# Altium schematic sheet STALO_3.SchDoc: STALO_3
size D; Date: 09-24-10; DrawnBy: C. Lewis; Engineer: C. Lewis; Address1: 4650 NORRIS CANYON RD.; Address2: SAN RAMON, CA 94583; DocumentNumber: 35133; Revision: D; SheetNumber: 20; SheetTotal: 20; PageSetup: Record=PageOptions|CenterHorizontal=True|CenterVertical=True|PrintScale=0.34|XCorrection=1.00|YCorrection=1.00|PrintKind=1|BorderSize=5000000|LeftOffset=0|BottomOffset=0|Orientation=2|PaperLength=1000|PaperWidth=1000|Scale=100|PaperSource=15|PrintQuality=600|MediaType=1|DitherType=10|PaperKind=11x17|PrintScaleMode=1; DocumentName: Sheet1.SCHDOC; ModifiedDate: 10-27-11
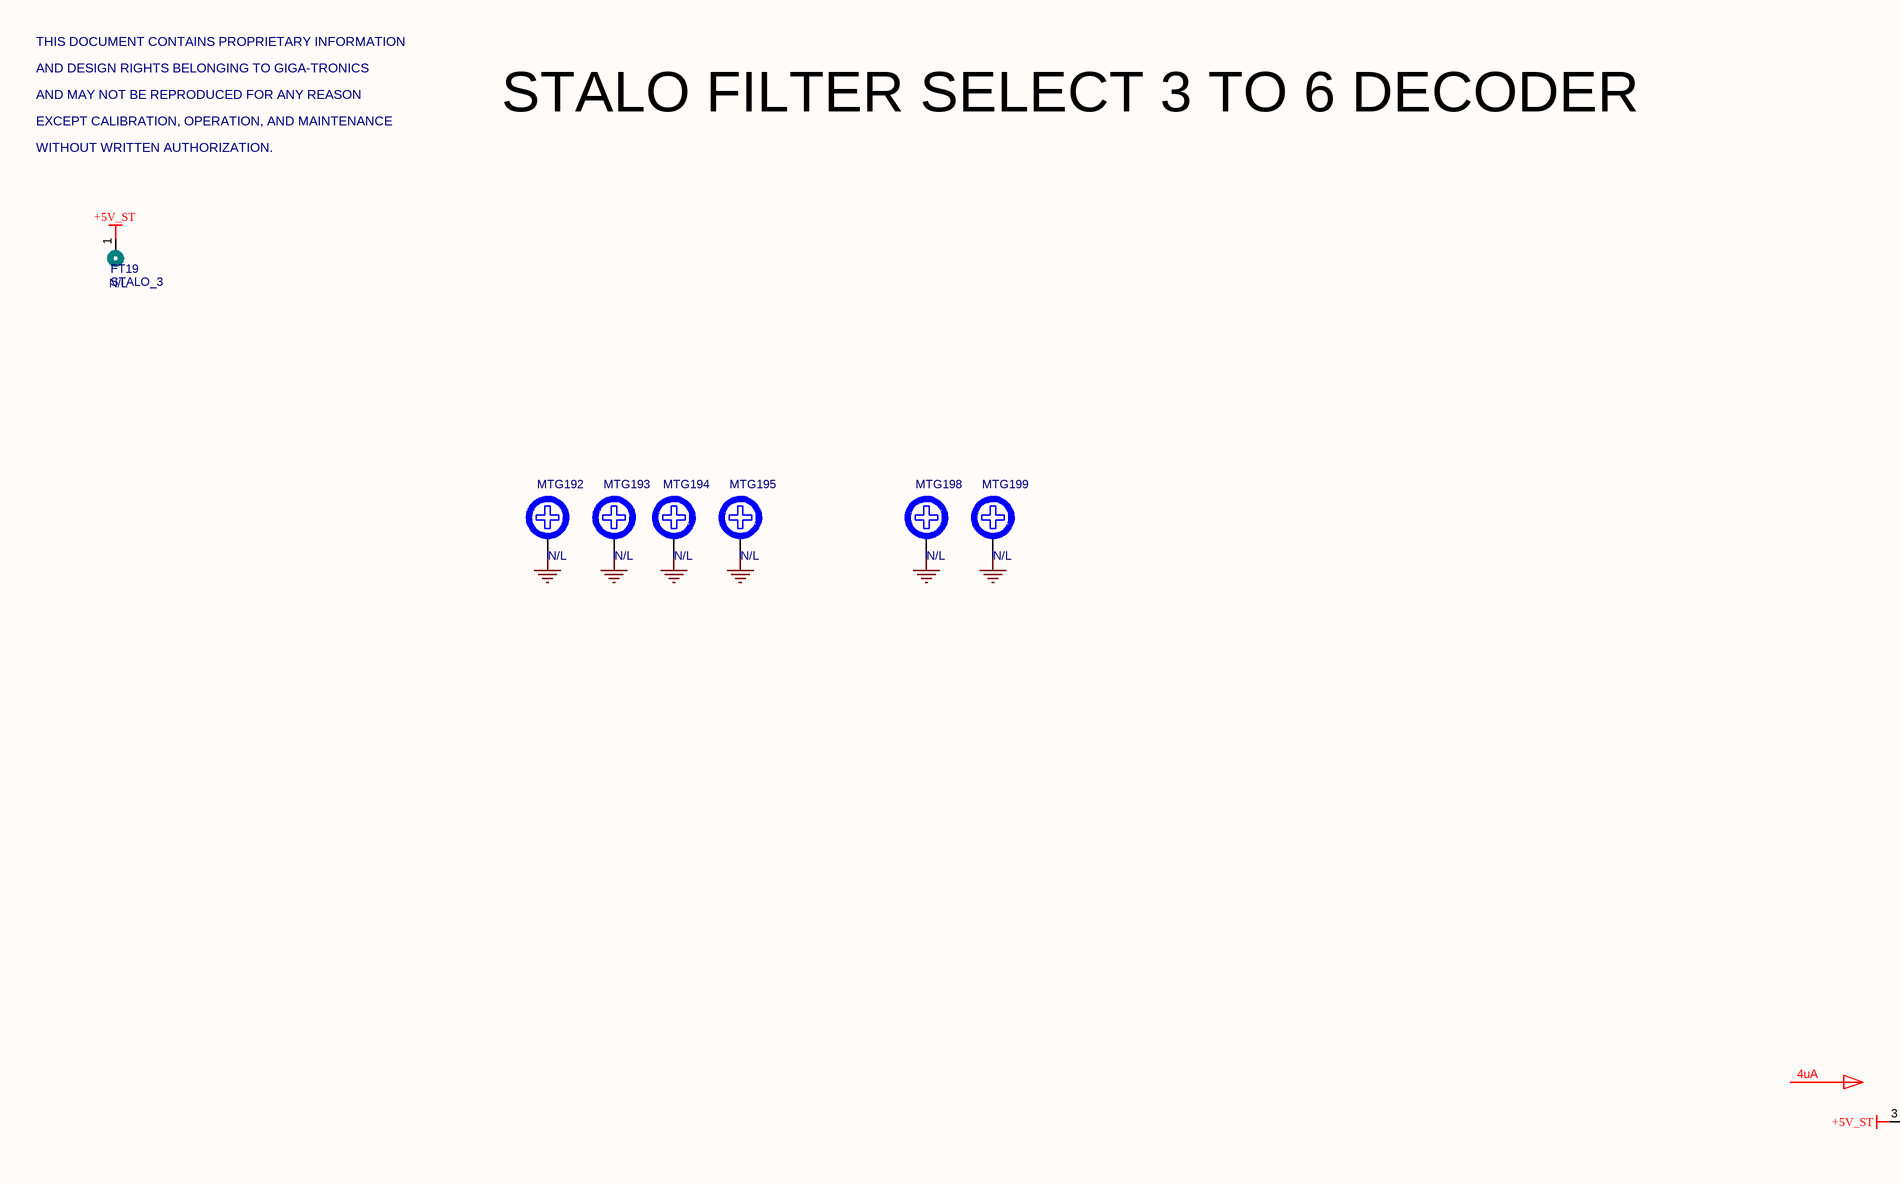
[diagram p0: STALO_3.SchDoc, top left]
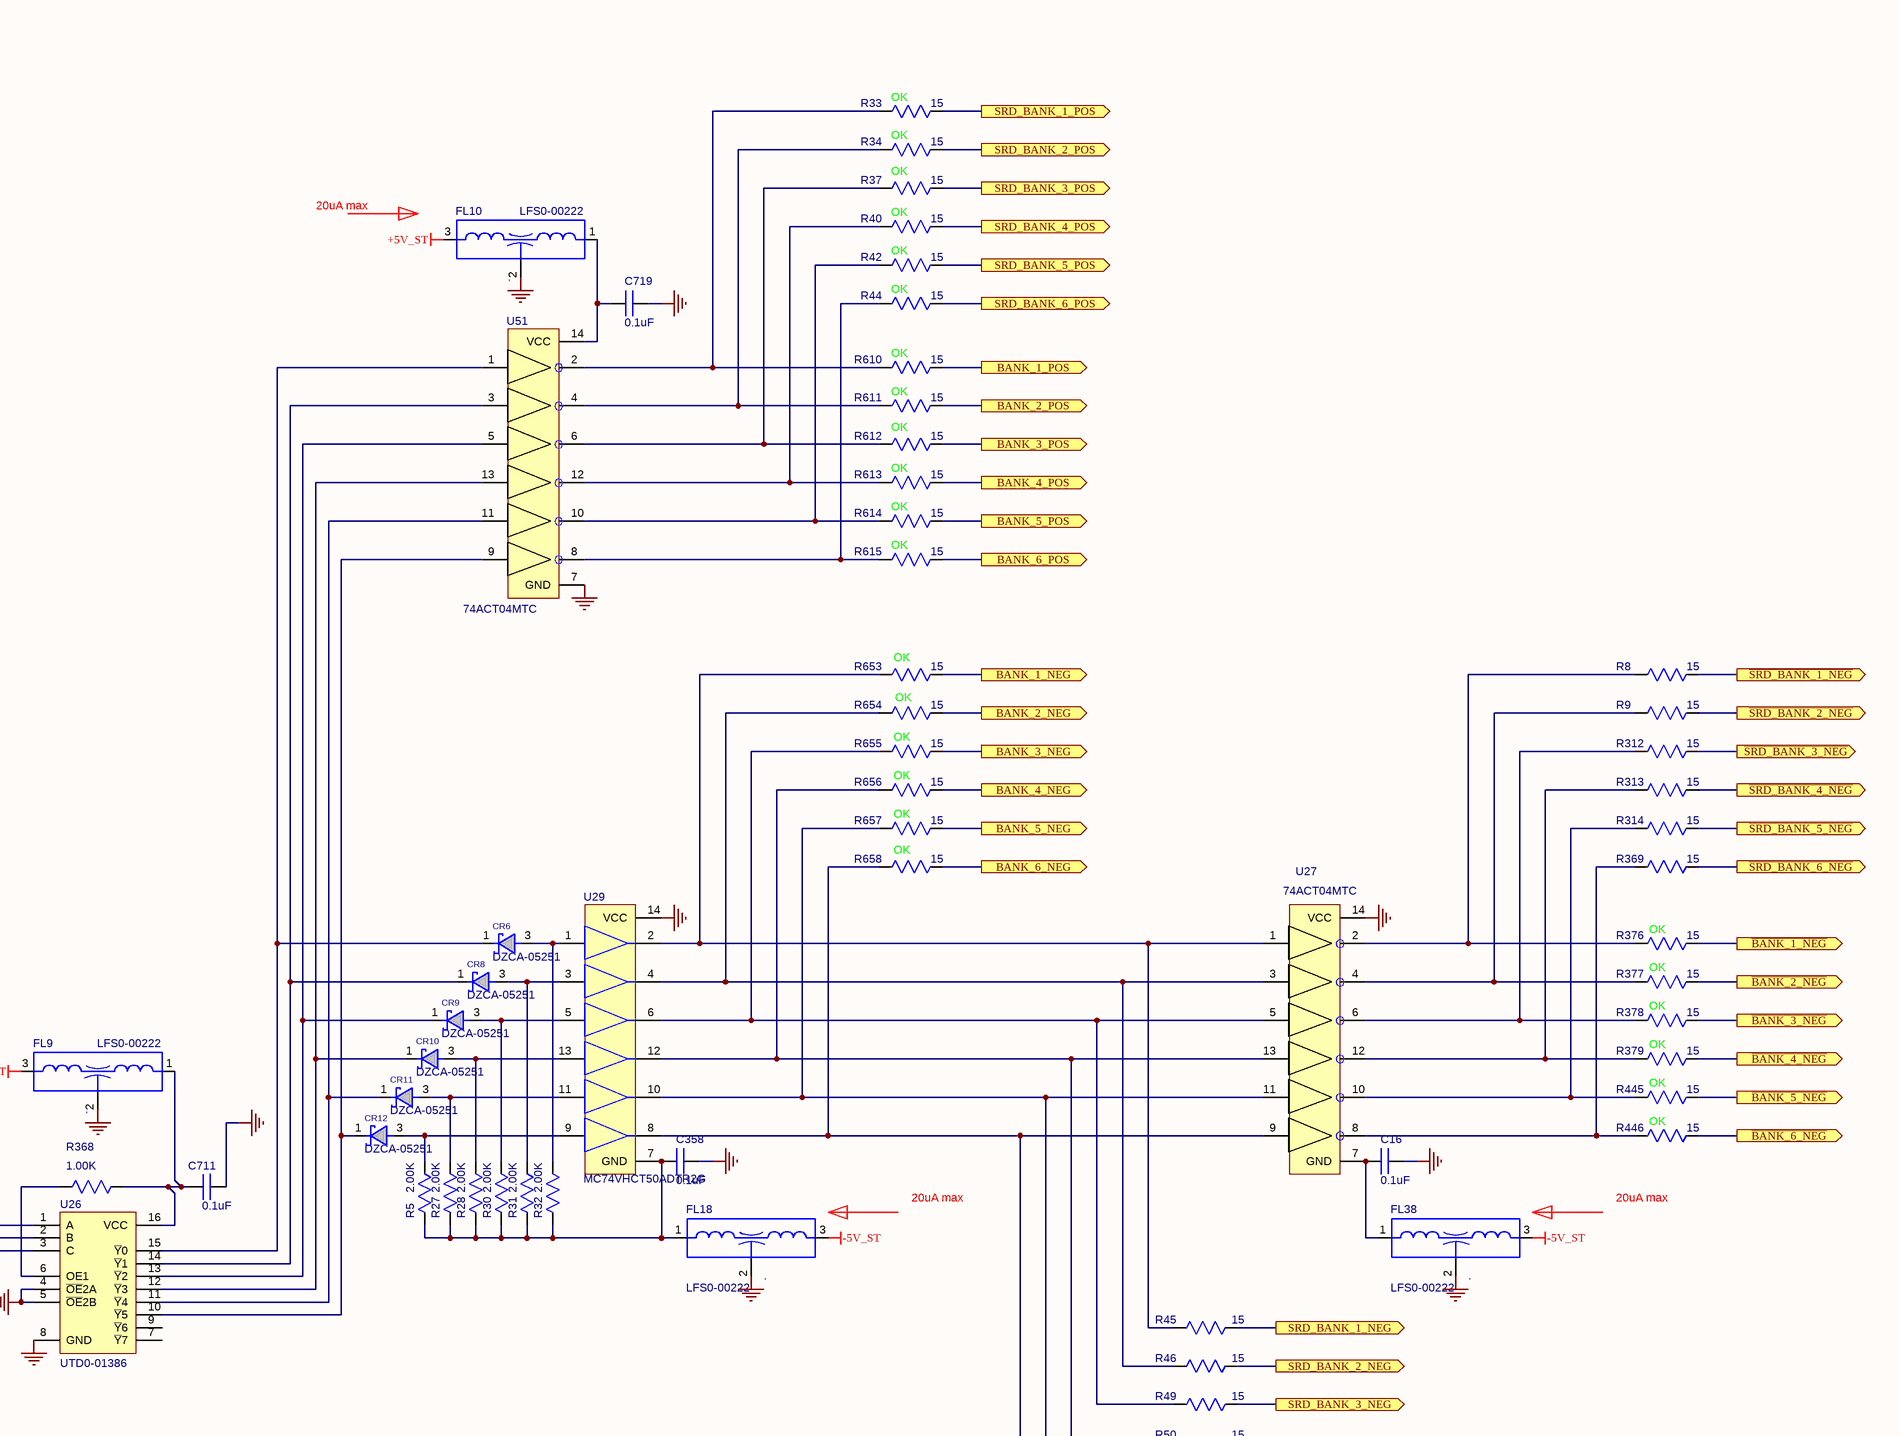
[diagram p1: STALO_3.SchDoc, top right]
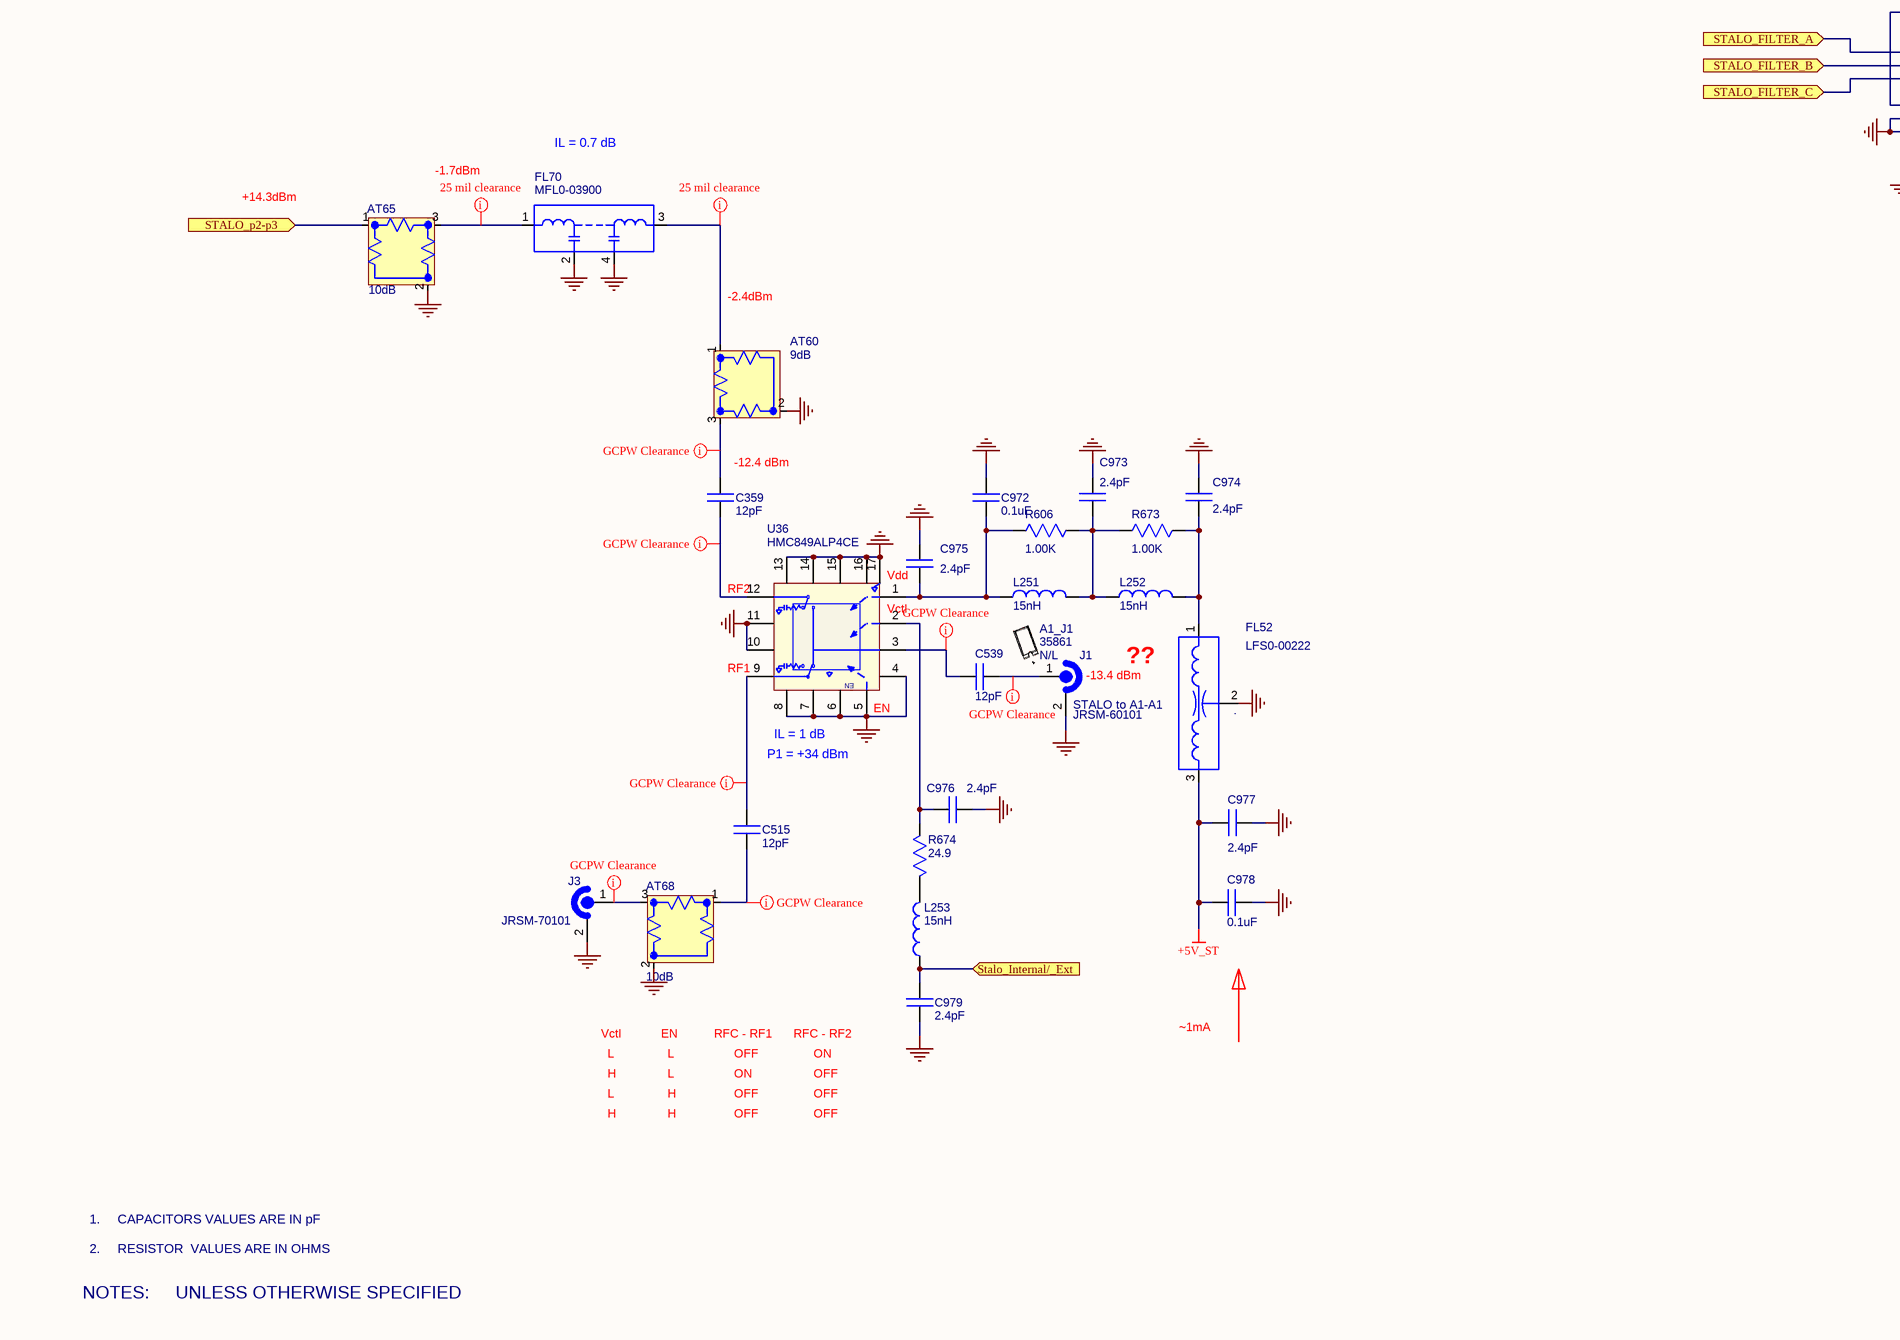
[diagram p2: STALO_3.SchDoc, bottom left]
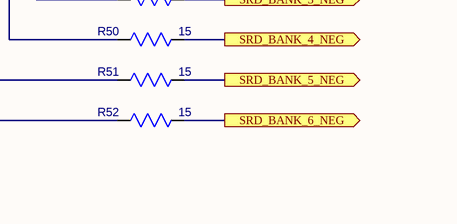
[diagram p3: STALO_3.SchDoc, bottom right]

## Parts
A1_J1  NoLoad: N/L  [35861]  (hidden comment: 35861)  (mechanical)
AT60  value 9dB  [ATTN-IMS-0805]  (hidden comment: PAD;CHIP;9dB;+/-.3dB;.08 x .05;50 OHM;FACE DOWN)
AT65  value 10dB  [ATTN-IMS-0805]  (hidden comment: PAD;CHIP;10dB;+/-.3dB;.08 x .05;50 OHM;FACE DOWN)
AT68  value 10dB  [ATTN-IMS-0805]  (hidden comment: PAD;CHIP;10dB;+/-.3dB;.08 x .05;50 OHM;FACE DOWN)
C16  value 0.1uF  [CAP-0402-N]  (hidden comment: .1 UF,10%;X7R;16V,CHIP;0402)
C358  value 0.1uF  [CAP-0402-N]  (hidden comment: .1 UF,10%;X7R;16V,CHIP;0402)
C359  value 12pF  [CAP-0402-N]  (hidden comment: 12 PF;5%;COG;>50V;CHIP;0402)
C515  value 12pF  [CAP-0402-N]  (hidden comment: 12 PF;5%;COG;>50V;CHIP;0402)
C539  value 12pF  [CAP-0402-N]  (hidden comment: 12 PF;5%;COG;>50V;CHIP;0402)
C711  value 0.1uF  [CAP-0402-N]  (hidden comment: .1 UF,10%;X7R;16V,CHIP;0402)
C719  value 0.1uF  [CAP-0402-N]  (hidden comment: .1 UF,10%;X7R;16V,CHIP;0402)
C972  value 0.1uF  [CAP-0402-N]  (hidden comment: .1 UF,10%;X7R;16V,CHIP;0402)
C973  value 2.4pF  [CAP-0402-RF]  (hidden comment: 2.4 PF;200V;.05PF;HIGH Q;SMT;CERAMIC;0402)
C974  value 2.4pF  [CAP-0402-RF]  (hidden comment: 2.4 PF;200V;.05PF;HIGH Q;SMT;CERAMIC;0402)
C975  value 2.4pF  [CAP-0402-RF]  (hidden comment: 2.4 PF;200V;.05PF;HIGH Q;SMT;CERAMIC;0402)
C976  value 2.4pF  [CAP-0402-RF]  (hidden comment: 2.4 PF;200V;.05PF;HIGH Q;SMT;CERAMIC;0402)
C977  value 2.4pF  [CAP-0402-RF]  (hidden comment: 2.4 PF;200V;.05PF;HIGH Q;SMT;CERAMIC;0402)
C978  value 0.1uF  [CAP-0402-N]  (hidden comment: .1 UF,10%;X7R;16V,CHIP;0402)
C979  value 2.4pF  [CAP-0402-RF]  (hidden comment: 2.4 PF;200V;.05PF;HIGH Q;SMT;CERAMIC;0402)
CR6  5.1V;5%;.15W;Z=20;0603  [DO-0603-SOD-523F]  (value not drawn)
CR8  5.1V;5%;.15W;Z=20;0603  [DO-0603-SOD-523F]  (value not drawn)
CR9  5.1V;5%;.15W;Z=20;0603  [DO-0603-SOD-523F]  (value not drawn)
CR10  5.1V;5%;.15W;Z=20;0603  [DO-0603-SOD-523F]  (value not drawn)
CR11  5.1V;5%;.15W;Z=20;0603  [DO-0603-SOD-523F]  (value not drawn)
CR12  5.1V;5%;.15W;Z=20;0603  [DO-0603-SOD-523F]  (value not drawn)
FL9  Filter EMI 2200PF,1206  [FIL-NFE31P-1206-4P]  (value not drawn)
FL10  Filter EMI 2200PF,1206  [FIL-NFE31P-1206-4P]  (value not drawn)
FL18  Filter EMI 2200PF,1206  [FIL-NFE31P-1206-4P]  (value not drawn)
FL38  Filter EMI 2200PF,1206  [FIL-NFE31P-1206-4P]  (value not drawn)
FL52  Filter EMI 2200PF,1206  [FIL-NFE31P-1206-4P]  (value not drawn)
FL70  FILTER;LOW PASS;3900MHz;7SEC;FV1206  [FV1206]  (value not drawn)
FT19  STALO_3  NoLoad: N/L  [FromToNode_ML2]  (net tie, no BOM)
J1  STALO to A1-A1  [JRSM-60101]
J3  .  [JRSM-70101]  (value not drawn)
L251  value 15nH  [IND-0402HP]  (hidden comment: INDUCTOR;15NH;2%;3.9GHZ SRF;85Q @1.7GHZ;.078 DCR;1.1A;0402)
L252  value 15nH  [IND-0402HP]  (hidden comment: INDUCTOR;15NH;2%;3.9GHZ SRF;85Q @1.7GHZ;.078 DCR;1.1A;0402)
L253  value 15nH  [IND-0402HP]  (hidden comment: INDUCTOR;15NH;2%;3.9GHZ SRF;85Q @1.7GHZ;.078 DCR;1.1A;0402)
MTG192  NoLoad: N/L  [MHP200X92]  (no BOM)
MTG193  NoLoad: N/L  [MHP200X92]  (no BOM)
MTG194  NoLoad: N/L  [MHP200X92]  (no BOM)
MTG195  NoLoad: N/L  [MHP200X92]  (no BOM)
MTG198  NoLoad: N/L  [MHP200X92]  (no BOM)
MTG199  NoLoad: N/L  [MHP200X92]  (no BOM)
R5  value 2.00K  [RES-0402-N]  (hidden comment: 2.00K OHMS;.06W;1%;200PPM;FILM;CHIP;0402)
R8  value 15  [RES-0402-N]  (hidden comment: 15 OHMS;.06W;1%;200PPM;FILM;CHIP;0402)
R9  value 15  [RES-0402-N]  (hidden comment: 15 OHMS;.06W;1%;200PPM;FILM;CHIP;0402)
R27  value 2.00K  [RES-0402-N]  (hidden comment: 2.00K OHMS;.06W;1%;200PPM;FILM;CHIP;0402)
R28  value 2.00K  [RES-0402-N]  (hidden comment: 2.00K OHMS;.06W;1%;200PPM;FILM;CHIP;0402)
R30  value 2.00K  [RES-0402-N]  (hidden comment: 2.00K OHMS;.06W;1%;200PPM;FILM;CHIP;0402)
R31  value 2.00K  [RES-0402-N]  (hidden comment: 2.00K OHMS;.06W;1%;200PPM;FILM;CHIP;0402)
R32  value 2.00K  [RES-0402-N]  (hidden comment: 2.00K OHMS;.06W;1%;200PPM;FILM;CHIP;0402)
R33  value 15  [RES-0402-N]  (hidden comment: 15 OHMS;.06W;1%;200PPM;FILM;CHIP;0402)
R34  value 15  [RES-0402-N]  (hidden comment: 15 OHMS;.06W;1%;200PPM;FILM;CHIP;0402)
R37  value 15  [RES-0402-N]  (hidden comment: 15 OHMS;.06W;1%;200PPM;FILM;CHIP;0402)
R40  value 15  [RES-0402-N]  (hidden comment: 15 OHMS;.06W;1%;200PPM;FILM;CHIP;0402)
R42  value 15  [RES-0402-N]  (hidden comment: 15 OHMS;.06W;1%;200PPM;FILM;CHIP;0402)
R44  value 15  [RES-0402-N]  (hidden comment: 15 OHMS;.06W;1%;200PPM;FILM;CHIP;0402)
R45  value 15  [RES-0402-N]  (hidden comment: 15 OHMS;.06W;1%;200PPM;FILM;CHIP;0402)
R46  value 15  [RES-0402-N]  (hidden comment: 15 OHMS;.06W;1%;200PPM;FILM;CHIP;0402)
R49  value 15  [RES-0402-N]  (hidden comment: 15 OHMS;.06W;1%;200PPM;FILM;CHIP;0402)
R50  value 15  [RES-0402-N]  (hidden comment: 15 OHMS;.06W;1%;200PPM;FILM;CHIP;0402)
R51  value 15  [RES-0402-N]  (hidden comment: 15 OHMS;.06W;1%;200PPM;FILM;CHIP;0402)
R52  value 15  [RES-0402-N]  (hidden comment: 15 OHMS;.06W;1%;200PPM;FILM;CHIP;0402)
R312  value 15  [RES-0402-N]  (hidden comment: 15 OHMS;.06W;1%;200PPM;FILM;CHIP;0402)
R313  value 15  [RES-0402-N]  (hidden comment: 15 OHMS;.06W;1%;200PPM;FILM;CHIP;0402)
R314  value 15  [RES-0402-N]  (hidden comment: 15 OHMS;.06W;1%;200PPM;FILM;CHIP;0402)
R368  value 1.00K  [RES-0402-N]  (hidden comment: 1.0K OHMS;.06W;1%;200PPM;FILM;CHIP;0402)
R369  value 15  [RES-0402-N]  (hidden comment: 15 OHMS;.06W;1%;200PPM;FILM;CHIP;0402)
R376  value 15  [RES-0402-N]  (hidden comment: 15 OHMS;.06W;1%;200PPM;FILM;CHIP;0402)
R377  value 15  [RES-0402-N]  (hidden comment: 15 OHMS;.06W;1%;200PPM;FILM;CHIP;0402)
R378  value 15  [RES-0402-N]  (hidden comment: 15 OHMS;.06W;1%;200PPM;FILM;CHIP;0402)
R379  value 15  [RES-0402-N]  (hidden comment: 15 OHMS;.06W;1%;200PPM;FILM;CHIP;0402)
R445  value 15  [RES-0402-N]  (hidden comment: 15 OHMS;.06W;1%;200PPM;FILM;CHIP;0402)
R446  value 15  [RES-0402-N]  (hidden comment: 15 OHMS;.06W;1%;200PPM;FILM;CHIP;0402)
R606  value 1.00K  [RES-0402-N]  (hidden comment: 1.0K OHMS;.06W;1%;200PPM;FILM;CHIP;0402)
R610  value 15  [RES-0402-N]  (hidden comment: 15 OHMS;.06W;1%;200PPM;FILM;CHIP;0402)
R611  value 15  [RES-0402-N]  (hidden comment: 15 OHMS;.06W;1%;200PPM;FILM;CHIP;0402)
R612  value 15  [RES-0402-N]  (hidden comment: 15 OHMS;.06W;1%;200PPM;FILM;CHIP;0402)
R613  value 15  [RES-0402-N]  (hidden comment: 15 OHMS;.06W;1%;200PPM;FILM;CHIP;0402)
R614  value 15  [RES-0402-N]  (hidden comment: 15 OHMS;.06W;1%;200PPM;FILM;CHIP;0402)
R615  value 15  [RES-0402-N]  (hidden comment: 15 OHMS;.06W;1%;200PPM;FILM;CHIP;0402)
R653  value 15  [RES-0402-N]  (hidden comment: 15 OHMS;.06W;1%;200PPM;FILM;CHIP;0402)
R654  value 15  [RES-0402-N]  (hidden comment: 15 OHMS;.06W;1%;200PPM;FILM;CHIP;0402)
R655  value 15  [RES-0402-N]  (hidden comment: 15 OHMS;.06W;1%;200PPM;FILM;CHIP;0402)
R656  value 15  [RES-0402-N]  (hidden comment: 15 OHMS;.06W;1%;200PPM;FILM;CHIP;0402)
R657  value 15  [RES-0402-N]  (hidden comment: 15 OHMS;.06W;1%;200PPM;FILM;CHIP;0402)
R658  value 15  [RES-0402-N]  (hidden comment: 15 OHMS;.06W;1%;200PPM;FILM;CHIP;0402)
R673  value 1.00K  [RES-0402-N]  (hidden comment: 1.0K OHMS;.06W;1%;200PPM;FILM;CHIP;0402)
R674  value 24.9  [RES-0402-N]  (hidden comment: 24.9 OHMS;.06W;1%;200PPM;FILM;CHIP;0402)
U26  UTD0-01386  [SOIC16_MS-012]
U27  M_PN: 74ACT04MTC  [TSOP65P640X120-14L]  (hidden comment: 74ACT04MTC HEX INVERTER;SMT;TSSOP-14)
U29  M_PN: MC74VHCT50ADTR2G  [TSOP65P640X120-14L]  (hidden comment: MC74VHCT50A;HEX BUFFERS;3.5NS;TTL INPUTS;TSSOP-14)
U36  M_PN: HMC849ALP4CE  [QFN-16_HITTITE_LP4CE]  (hidden comment: SWITCH;SPDT;DC-6GHz;50DB ISO;33DBM;3-5V CTRL;QFN-16)
U51  M_PN: 74ACT04MTC  [TSOP65P640X120-14L]  (hidden comment: 74ACT04MTC HEX INVERTER;SMT;TSSOP-14)

## Ports
BANK_1_NEG, BANK_1_POS, BANK_2_NEG, BANK_2_POS, BANK_3_NEG, BANK_3_POS, BANK_4_NEG, BANK_4_POS, BANK_5_NEG, BANK_5_POS, BANK_6_NEG, BANK_6_POS, SRD_BANK_1_NEG, SRD_BANK_1_POS, SRD_BANK_2_NEG, SRD_BANK_2_POS, SRD_BANK_3_NEG, SRD_BANK_3_POS, SRD_BANK_4_NEG, SRD_BANK_4_POS, SRD_BANK_5_NEG, SRD_BANK_5_POS, SRD_BANK_6_NEG, SRD_BANK_6_POS, STALO_FILTER_A, STALO_FILTER_B, STALO_FILTER_C, Stalo_Internal/_Ext, STALO_p2-p3, ~{BANK_1_NEG}, ~{BANK_2_NEG}, ~{BANK_3_NEG}, ~{BANK_4_NEG}, ~{BANK_5_NEG}, ~{BANK_6_NEG}, ~{SRD_BANK_1_NEG}, ~{SRD_BANK_2_NEG}, ~{SRD_BANK_3_NEG}, ~{SRD_BANK_4_NEG}, ~{SRD_BANK_5_NEG}, ~{SRD_BANK_6_NEG}

## Nets
+5V_ST: C977.2 C978.1 FL9.3(OUT) FL10.3(OUT) FL52.3(OUT) FT19.1
-5V_ST: FL18.3(OUT) FL38.3(OUT)
GND: AT60.2(GND) AT65.2(GND) AT68.2(GND) C16.2 C358.2 C711.2 C719.2 C972.2 C973.1 C974.1 C975.1 C976.2 C977.1 C978.2 C979.1 FL9.2(GND) FL10.2(GND) FL18.2(GND) FL38.2(GND) FL52.2(GND) FL70.2(OUT) FL70.4(GND) J1.2(GND) J3.2(GND) MTG192.MH MTG193.MH MTG194.MH MTG195.MH MTG198.MH MTG199.MH U26.4(~{OE}2A) U26.5(~{OE}2B) U26.8(GND) U27.14(VCC) U29.14(VCC) U36.4(NC) U36.5(EN) U36.6(NC) U36.7(NC) U36.8(NC) U36.10(GND) U36.11(GND) U36.13(NC) U36.14(NC) U36.15(NC) U36.16(NC) U36.17(GND) U51.7(GND)
~{BANK_1_NEG}: R376.2 ; port ~{BANK_1_NEG}
~{BANK_2_NEG}: R377.2 ; port ~{BANK_2_NEG}
~{BANK_3_NEG}: R378.2 ; port ~{BANK_3_NEG}
~{BANK_4_NEG}: R379.2 ; port ~{BANK_4_NEG}
~{BANK_5_NEG}: R445.2 ; port ~{BANK_5_NEG}
~{BANK_6_NEG}: R446.2 ; port ~{BANK_6_NEG}
BANK_1_NEG: R653.2 ; port BANK_1_NEG
BANK_1_POS: R610.2 ; port BANK_1_POS
BANK_2_NEG: R654.2 ; port BANK_2_NEG
BANK_2_POS: R611.2 ; port BANK_2_POS
BANK_3_NEG: R655.2 ; port BANK_3_NEG
BANK_3_POS: R612.2 ; port BANK_3_POS
BANK_4_NEG: R656.2 ; port BANK_4_NEG
BANK_4_POS: R613.2 ; port BANK_4_POS
BANK_5_NEG: R657.2 ; port BANK_5_NEG
BANK_5_POS: R614.2 ; port BANK_5_POS
BANK_6_NEG: R658.2 ; port BANK_6_NEG
BANK_6_POS: R615.2 ; port BANK_6_POS
~{SRD_BANK_1_NEG}: R8.2 ; port ~{SRD_BANK_1_NEG}
~{SRD_BANK_2_NEG}: R9.2 ; port ~{SRD_BANK_2_NEG}
~{SRD_BANK_3_NEG}: R312.2 ; port ~{SRD_BANK_3_NEG}
~{SRD_BANK_4_NEG}: R313.2 ; port ~{SRD_BANK_4_NEG}
~{SRD_BANK_5_NEG}: R314.2 ; port ~{SRD_BANK_5_NEG}
~{SRD_BANK_6_NEG}: R369.2 ; port ~{SRD_BANK_6_NEG}
SRD_BANK_1_NEG: R45.2 ; port SRD_BANK_1_NEG
SRD_BANK_1_POS: R33.2 ; port SRD_BANK_1_POS
SRD_BANK_2_NEG: R46.2 ; port SRD_BANK_2_NEG
SRD_BANK_2_POS: R34.2 ; port SRD_BANK_2_POS
SRD_BANK_3_NEG: R49.2 ; port SRD_BANK_3_NEG
SRD_BANK_3_POS: R37.2 ; port SRD_BANK_3_POS
SRD_BANK_4_NEG: R50.2 ; port SRD_BANK_4_NEG
SRD_BANK_4_POS: R40.2 ; port SRD_BANK_4_POS
SRD_BANK_5_NEG: R51.2 ; port SRD_BANK_5_NEG
SRD_BANK_5_POS: R42.2 ; port SRD_BANK_5_POS
SRD_BANK_6_NEG: R52.2 ; port SRD_BANK_6_NEG
SRD_BANK_6_POS: R44.2 ; port SRD_BANK_6_POS
STALO_FILTER_A: U26.1(A) ; port STALO_FILTER_A
STALO_FILTER_B: U26.2(B) ; port STALO_FILTER_B
STALO_FILTER_C: U26.3(C) ; port STALO_FILTER_C
Stalo_Internal/_Ext: C979.2 L253.2 ; port Stalo_Internal/_Ext
STALO_p2-p3: AT65.1(IN/OUT) ; port STALO_p2-p3
NetAT60_1: AT60.1(IN/OUT) FL70.3(GND)
NetAT60_3: AT60.3(IN/OUT) C359.2
NetAT65_3: AT65.3(IN/OUT) FL70.1(IN)
NetAT68_1: AT68.1(IN/OUT) C515.1
NetAT68_3: AT68.3(IN/OUT) J3.1(CNTR)
NetC16_1: C16.1 FL38.1(IN) U27.7(GND)
NetC358_1: C358.1 FL18.1(IN) R5.1 R27.1 R28.1 R30.1 R31.1 R32.1 U29.7(GND)
NetC359_1: C359.1 U36.12(RF2)
NetC515_2: C515.2 U36.9(RF1)
NetC539_1: C539.1 J1.1(CNTR)
NetC539_2: C539.2 U36.3(RFC)
NetC711_1: C711.1 FL9.1(IN) R368.2 U26.16(VCC)
NetC719_1: C719.1 FL10.1(IN) U51.14(VCC)
NetC972_1: C972.1 C975.2 L251.1 R606.1 U36.1(Vdd)
NetC973_2: C973.2 L251.2 L252.1 R606.2 R673.1
NetC974_2: C974.2 FL52.1(IN) L252.2 R673.2
NetC976_1: C976.1 R674.1 U36.2(Vctl)
NetCR6_1: CR6.1(K) U26.15(~{Y}0) U51.1
NetCR6_3: CR6.3(A) R32.2 U29.1
NetCR8_1: CR8.1(K) U26.14(~{Y}1) U51.3
NetCR8_3: CR8.3(A) R31.2 U29.3
NetCR9_1: CR9.1(K) U26.13(~{Y}2) U51.5
NetCR9_3: CR9.3(A) R30.2 U29.5
NetCR10_1: CR10.1(K) U26.12(~{Y}3) U51.13
NetCR10_3: CR10.3(A) R28.2 U29.13
NetCR11_1: CR11.1(K) U26.11(~{Y}4) U51.11
NetCR11_3: CR11.3(A) R27.2 U29.11
NetCR12_1: CR12.1(K) U26.10(~{Y}5) U51.9
NetCR12_3: CR12.3(A) R5.2 U29.9
NetL253_1: L253.1 R674.2
NetR8_1: R8.1 R376.1 U27.2
NetR9_1: R9.1 R377.1 U27.4
NetR33_1: R33.1 R610.1 U51.2
NetR34_1: R34.1 R611.1 U51.4
NetR37_1: R37.1 R612.1 U51.6
NetR40_1: R40.1 R613.1 U51.12
NetR42_1: R42.1 R614.1 U51.10
NetR44_1: R44.1 R615.1 U51.8
NetR45_1: R45.1 R653.1 U27.1 U29.2
NetR46_1: R46.1 R654.1 U27.3 U29.4
NetR49_1: R49.1 R655.1 U27.5 U29.6
NetR50_1: R50.1 R656.1 U27.13 U29.12
NetR51_1: R51.1 R657.1 U27.11 U29.10
NetR52_1: R52.1 R658.1 U27.9 U29.8
NetR312_1: R312.1 R378.1 U27.6
NetR313_1: R313.1 R379.1 U27.12
NetR314_1: R314.1 R445.1 U27.10
NetR368_1: R368.1 U26.6(OE1)
NetR369_1: R369.1 R446.1 U27.8

Not connected (* = marked no-connect by the designer): U26 7(~{Y}7) 9(~{Y}6)

## Layout directives
net class GCPW Clearance: NetAT60_3, NetAT68_1, NetAT68_3, NetC359_1, NetC515_2, NetC539_1, NetC539_2
net class 25 mil clearance: NetAT60_1, NetAT65_3

## Notes on the sheet
- AND DESIGN RIGHTS BELONGING TO GIGA-TRONICS
- THIS DOCUMENT CONTAINS PROPRIETARY INFORMATION
- EXCEPT CALIBRATION, OPERATION, AND MAINTENANCE
- AND MAY NOT BE REPRODUCED FOR ANY REASON
- STALO FILTER SELECT 3 TO 6 DECODER
- (near R33) OK
- WITHOUT WRITTEN AUTHORIZATION.
- (near R34) OK
- OK
- 20uA max
- (near R40) OK
- (near R42) OK
- (near R44) OK
- (near R610) OK
- (near R611) OK
- (near R613) OK
- (near R614) OK
- (near R615) OK
- (near R653) OK
- (near R654) OK
- (near R655) OK
- (near R656) OK
- (near R657) OK
- (near R376) OK
- (near R377) OK
- (near R378) OK
- 4uA
- (near R379) OK
- (near R445) OK
- (near R446) OK
- IL = 0.7 dB
- +14.3dBm
- -1.7dBm
- -2.4dBm
- (near C359) -12.4 dBm
- (near U36) RF2
- (near U36) Vdd
- (near U36) Vctl
- (near U36) RF1
- (near J1) -13.4 dBm
- ??
- P1 = +34 dBm
- (near U36) IL = 1 dB
- (near U36) EN
- Vctl
- EN
- RFC - RF1
- RFC - RF2
- ~1mA
- L
- H
- OFF
- ON
- 1.     CAPACITORS VALUES ARE IN pF
- NOTES:
- 2.     RESISTOR  VALUES ARE IN OHMS
- UNLESS OTHERWISE SPECIFIED
- Title
- Sheet Title
- PRINTED DOCUMENT IS CONSIDERED UNCONTROLLED. VERIFY REVISION IN PLM SYSTEM.
- THIS DOCUMENT CONTAINS PROPRIETARY INFORMATION. DESIGN RIGHTS BELONG TO GIGA-TRONICS AND MAY NOT BE REPRODUCED WITHOUT WRITTEN AUTHORIZATION FOR ANY REASON EXCEPT CALIBRATION, OPERATION AND MAINTENANCE.
- Size
- CAGE CODE
- Filename
- D
- Document Number
- 58900
- Date
- Sheet
- Rev
- of
- (in symbol LFS0-00222) ,

## Library data of the parts
A1_J1 = 35861: SHIELD,HYDRA,A1-J1; MFGR: Any; Approved: MH; level: 1; ModifyDate: 08/28/15; M_PN: Any; G_PN: 35861; Value: 35861; item_number: 35861
AT60 = MPFC-A1009: NoLoad: .; Approved: CL; M_PN: IMS1141-09DB; MFGR: IMS RESISTORS; level: 1; line_number: 40; ModifyDate: 3/.8/13; G_PN: MPFC-A1009; item_number: MPFC-A1009
AT65 AT68 = MPFC-A1010: NoLoad: .; Approved: CL; M_PN: IMS1141-10DB; MFGR: IMS RESISTORS; level: 1; line_number: 55; ModifyDate: 4/23/13; G_PN: MPFC-A1010; item_number: MPFC-A1010
C16 C358 C711 C719 = CK40-04100: Approved: CL; NoLoad: .; MFGR: VENKEL; M_PN: C0402X7R160-104KNP; level: 1; line_number: 95; ModifyDate: 3/29/13; G_PN: CK40-04100; item_number: CK40-04100
  C16 C358: ClassName: FSb
  C719: ClassName: FSa
C359 C515 C539 = CK40-00120: MFGR: ANY; Approved: CL; NoLoad: .; level: 1; line_number: 165; ModifyDate: 10/06/12; M_PN: ANY; G_PN: CK40-00120; item_number: CK40-00120
C972 C978 = CK40-04100: Approved: CL; NoLoad: .; M_PN: C0402X7R160-104KNP; MFGR: VENKEL; level: 1; line_number: 95; ModifyDate: 3/29/13; G_PN: CK40-04100; item_number: CK40-04100
C973-C975 C977 = CK41-00024: NoLoad: .; MFGR: ATC; M_PN: 600L2R4AT200; Approved: CL; level: 1; line_number: 60; G_PN: CK41-00024; ModifyDate: 02/09/13; item_number: CK41-00024
C976 C979 = CK41-00024: MFGR: ATC; M_PN: 600L2R4AT200; Approved: CL; NoLoad: .; level: 1; line_number: 60; ModifyDate: 02/09/13; G_PN: CK41-00024; item_number: CK41-00024
CR6 CR8-CR12 = DZCA-05251: Value: CZRU52C5V1; NoLoad: .; Approved: CL; level: 1; line_number: 333; M_PN: 5.1V;5%;.15W;Z=20;0603; ModifyDate: 01/08/14; G_PN: DZCA-05251; item_number: DZCA-05251
FL9 FL10 FL18 FL38 FL52 = LFS0-00222: Approved: CL; NoLoad: .; M_PN: NFE31PT222Z1E9BL; MFGR: MURATA; level: 1; line_number: 335; G_PN: LFS0-00222; ModifyDate: 02/22/12; Value: 2200pF; item_number: LFS0-00222
  FL10: ClassName: FSa
  FL18 FL38: ClassName: FSb
FL70 = MFL0-03900: NoLoad: .; MFGR: Mini-Circuits; Approved: NM; level: 1; line_number: 440; ModifyDate: 11/17/12; M_PN: LFCN-3800; G_PN: MFL0-03900; item_number: MFL0-03900
FT19 = FromToNode: level: 1; Approved: *; G_PN: *; MFGR: *; Value: *
J1 = JRSM-60101: SMPM SM MALE,STRAIGHT SMT, R/A COPLANAR, 4 PIN THRU-HOLE; Value: B012-P95-02; MFGR: GILBERT; Approved: CL; NoLoad: .; level: 1; line_number: 483; M_PN: B012-P95-02; ModifyDate: 1/6/14; G_PN: JRSM-60101; item_number: JRSM-60101
J3 = JRSM-70101: SMPM FD MALE,STRAIGHT SMT, R/A COPLANAR, 4 PIN THRU-HOLE; Value: B012-P93-02; MFGR: GILBERT; Approved: CL; level: 1; line_number: 480; M_PN: B012-P93-02; NoLoad: .; ModifyDate: 10/15/14; G_PN: JRSM-70101; item_number: JRSM-70101
L251 L252 = LSA6-03150: M_PN: 0402HP-15NXGLU; MFGR: COILCRAFT; NoLoad: .; Approved: CL; level: 1; line_number: 515; G_PN: LSA6-03150; ModifyDate: 3/8/13; item_number: LSA6-03150
L253 = LSA6-03150: MFGR: COILCRAFT; NoLoad: .; Approved: CL; M_PN: 0402HP-15NXGLU; level: 1; line_number: 515; ModifyDate: 3/8/13; G_PN: LSA6-03150; item_number: LSA6-03150
MTG192-MTG195 MTG198 MTG199 = MHP200X92: level: 1; ModifyDate: 02/14/2008 14:07:19; Value: *
R5 R27 R28 R30-R32 = RK35-12000: Approved: CL; NoLoad: .; MFGR: ANY; level: 1; line_number: 660; G_PN: RK35-12000; ModifyDate: 02/22/12; M_PN: ANY; item_number: RK35-12000
R8 R9 R33 R34 R37 R40 R42 R44-R46 R49-R52 R312-R314 R369 R376-R379 R445 R446 R610-R615 R653-R658 = RK35-00150: Approved: CL; NoLoad: .; MFGR: ANY; level: 1; line_number: 915; G_PN: RK35-00150; ModifyDate: 02/22/13; M_PN: ANY; item_number: RK35-00150
  R8 R9 R45 R46 R49-R52 R312-R314 R369: ClassName: FSc
  R33 R34 R37 R40 R42 R44 R610-R615: ClassName: FSa
  R376-R379 R445 R446 R653-R658: ClassName: FSb
R368 = RK35-11000: Approved: CL; NoLoad: .; MFGR: ANY; level: 1; line_number: 1025; G_PN: RK35-11000; ModifyDate: 02/22/12; M_PN: ANY; item_number: RK35-11000
R606 R673 = RK35-11000: NoLoad: .; Approved: CL; MFGR: ANY; level: 1; line_number: 1025; G_PN: RK35-11000; ModifyDate: 02/22/12; M_PN: ANY; item_number: RK35-11000
R674 = RK35-00249: NoLoad: .; Approved: CL; MFGR: ANY; level: 1; line_number: 655; G_PN: RK35-00249; ModifyDate: 02/22/12; M_PN: ANY; item_number: RK35-00249
U26 = UTD0-01386: 3 TO 8 DECODER/DEMULTIPLEXER;74ACT138 LOGIC;SO-16; Approved: NM; MFGR: FAIRCHILD; M_PN: 74ACT138SC; NoLoad: .; level: 1; line_number: 1165; ModifyDate: 11/8/12; Value: *; G_PN: UTD0-01386; item_number: UTD0-01386
U27 U51 = UTD4-00046: MFGR: Fairchild; NoLoad: .; Approved: NM; level: 1; line_number: 1175; Value: *; ModifyDate: 10/27/12; G_PN: UTD4-00046; item_number: UTD4-00046
  U27: ClassName: FSb
  U51: ClassName: FSa
U29 = UTD0-00050: Value: MC74VHCT50ADTR2G; MFGR: ON SEMI; NoLoad: .; Approved: CL; level: 1; line_number: 1177; ModifyDate: 4/21/13; G_PN: UTD0-00050; ClassName: FSb; item_number: UTD0-00050
U36 = MRSS-12206: MFGR: HITTITE; Approved: CL; Value: HMC849ALP4CE; NoLoad: .; level: 1; line_number: 1347; ModifyDate: 8/5/14; G_PN: MRSS-12206; item_number: MRSS-12206